# EAGLE design dog_treat_launcher (EAGLE 9.6.2)
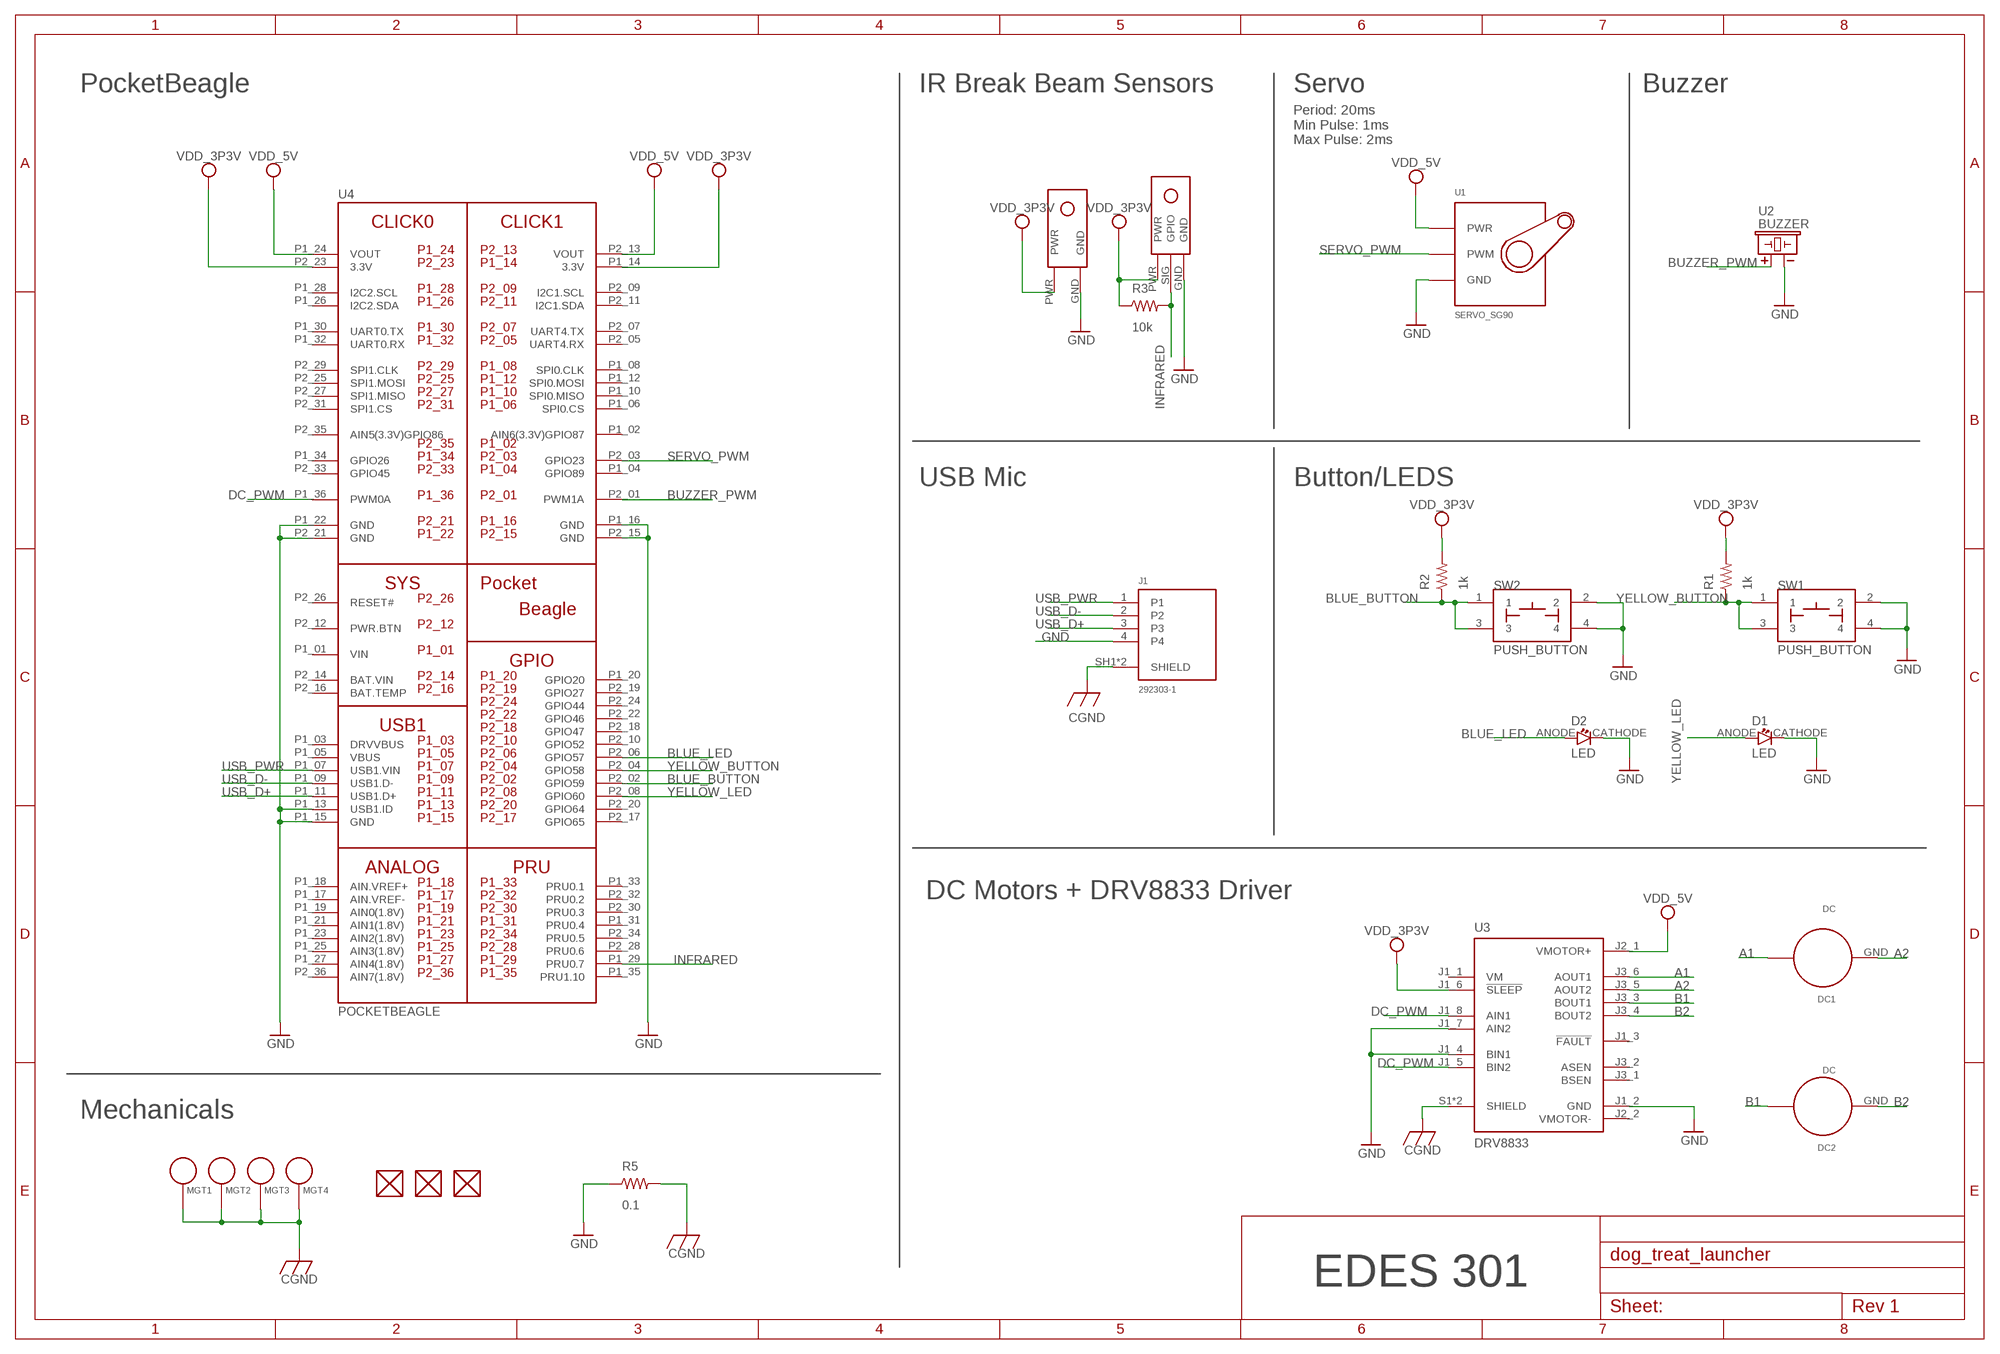
[diagram p0: schematic, sheet 1]

## Parts
D1  LED  [EIA-STD]
D2  LED  [EIA-STD]
DC1  DC  [DC_FOOTPRINT]
DC2  DC  [DC_FOOTPRINT]
FUD1  FIDUCIAL  [FIDUCIAL_40MIL]
FUD2  FIDUCIAL  [FIDUCIAL_40MIL]
FUD3  FIDUCIAL  [FIDUCIAL_40MIL]
IR_T1  IR_TRANSMITTER  [IR_T]
IT_R1  IR_RECIEVER  [IR_R]
J1  292303-1  [TE_292303-1]
MGT1  MOUNTING_HOLE  [MOUNTING_HOLE]
MGT2  MOUNTING_HOLE  [MOUNTING_HOLE]
MGT3  MOUNTING_HOLE  [MOUNTING_HOLE]
MGT4  MOUNTING_HOLE  [MOUNTING_HOLE]
R1  1k  R_R0402  [R0402]
R2  1k  R_R0402  [R0402]
R3  10k  R_R0402  [R0402]
R5  0.1  R_R0402  [R0402]
SW1  PUSH_BUTTON  [BUTTON_12.5MM]
SW2  PUSH_BUTTON  [BUTTON_12.5MM]
U1  SERVO_SG90  [SERVO-X1]
U2  BUZZER  [BUZZER_6.5MM]
U3  DRV8833  [MODULE_3297]
U4  POCKETBEAGLE  [POCKETBEAGLE]

## Nets
A1: DC1.PWR U3.J3_6(AOUT1)
A2: DC1.GND U3.J3_5(AOUT2)
B1: DC2.PWR U3.J3_3(BOUT1)
B2: DC2.GND U3.J3_4(BOUT2)
BLUE_BUTTON: R2.1 SW2.1 SW2.3 U4.P2_02(GPIO59)
BLUE_LED: D2.ANODE U4.P2_06(GPIO57)
BUZZER_PWM: U2.+ U4.P2_01(PWM1A)
CGND: J1.SH1(SHIELD) J1.SH2(SHIELD) MGT1.P$1 MGT2.P$1 MGT3.P$1 MGT4.P$1 R5.2 U3.S1(SHIELD) U3.S2(SHIELD)
DC_PWM: U3.J1_5(BIN2) U3.J1_8(AIN1) U4.P1_36(PWM0A)
GND: D1.CATHODE D2.CATHODE IR_T1.GND IT_R1.GND J1.4 R5.1 SW1.2 SW1.4 SW2.2 SW2.4 U1.GND U2.- U3.J1_2(GND) U3.J1_4(BIN1) U3.J1_7(AIN2) U4.P1_13(USB1.ID) U4.P1_15(GND) U4.P1_16(GND) U4.P1_22(GND) U4.P2_15(GND) U4.P2_21(GND)
INFRARED: IT_R1.SIG(GPIO) R3.2 U4.P1_29(PRU0.7)
SERVO_PWM: U1.SIG(PWM) U4.P2_03(GPIO23)
USB_D+: J1.3 U4.P1_11(USB1.D+)
USB_D-: J1.2 U4.P1_09(USB1.D-)
USB_PWR: J1.1 U4.P1_07(USB1.VIN)
VDD_3P3V: IR_T1.PWR IT_R1.PWR R1.2 R2.2 R3.1 U3.J1_6(!SLEEP) U4.P1_14(3.3V) U4.P2_23(3.3V)
VDD_5V: U1.PWR U3.J2_1(VMOTOR+) U4.P1_24(VOUT) U4.P2_13(VOUT)
YELLOW_BUTTON: R1.1 SW1.1 SW1.3 U4.P2_04(GPIO58)
YELLOW_LED: D1.ANODE U4.P2_08(GPIO60)
Unconnected: FUD1.P$1 FUD2.P$1 FUD3.P$1 U3.J1_1(VM) U3.J1_3(!FAULT) U3.J3_1(BSEN) U3.J3_2(ASEN) U4.P1_02(AIN6(3.3V)GPIO87) U4.P1_03(DRVVBUS) U4.P1_04(GPIO89) U4.P1_05(VBUS) U4.P1_06(SPI0.CS) U4.P1_08(SPI0.CLK) U4.P1_10(SPI0.MISO) U4.P1_12(SPI0.MOSI) U4.P1_17(AIN.VREF-) U4.P1_18(AIN.VREF+) U4.P1_19(AIN0(1.8V)) U4.P1_20(GPIO20) U4.P1_21(AIN1(1.8V)) U4.P1_23(AIN2(1.8V)) U4.P1_25(AIN3(1.8V)) U4.P1_26(I2C2.SDA) U4.P1_27(AIN4(1.8V)) U4.P1_28(I2C2.SCL) U4.P1_30(UART0.TX) U4.P1_31(PRU0.4) U4.P1_32(UART0.RX) U4.P1_33(PRU0.1) U4.P1_34(GPIO26) U4.P1_35(PRU1.10) U4.P2_05(UART4.RX) U4.P2_07(UART4.TX) U4.P2_09(I2C1.SCL) U4.P2_10(GPIO52) U4.P2_11(I2C1.SDA) U4.P2_12(PWR.BTN) U4.P2_16(BAT.TEMP) U4.P2_17(GPIO65) U4.P2_18(GPIO47) U4.P2_19(GPIO27) U4.P2_20(GPIO64) U4.P2_22(GPIO46) U4.P2_24(GPIO44) U4.P2_25(SPI1.MOSI) U4.P2_26(RESET#) U4.P2_27(SPI1.MISO) U4.P2_28(PRU0.6) U4.P2_29(SPI1.CLK) U4.P2_30(PRU0.3) U4.P2_31(SPI1.CS) U4.P2_32(PRU0.2) U4.P2_33(GPIO45) U4.P2_34(PRU0.5) U4.P2_35(AIN5(3.3V)GPIO86) U4.P2_36(AIN7(1.8V))

## Notes on the sheet
- PocketBeagle | IR Break Beam Sensors | Servo | Buzzer
- Period: 20ms
  Min Pulse: 1ms
  Max Pulse: 2ms
- USB Mic | Button/LEDS
- DC Motors + DRV8833 Driver
- Mechanicals
- EDES 301

## Power pins joined to a net without a drawn wire
BAT.VIN: U4.P2_14(BAT.VIN)
VIN: U4.P1_01(VIN)
VMOTOR-: U3.J2_2(VMOTOR-)

## Library data of the parts
D1 D2 = Dog_Treat_Launcher:LED: EIA-STD LED, LTST-C191T8KT
DC1 DC2 = Dog_Treat_Launcher:DC: Device representation of hobby DC Motor
FUD1-FUD3 = MISC:FIDUCIAL
IR_T1 = Dog_Treat_Launcher:IR_TRANSMITTER: Device representation of IR Break Beam Sensor
IT_R1 = Dog_Treat_Launcher:IR_RECIEVER: Device representation of Adafruit IR Break Beam Sensor Receiver
J1 = Dog_Treat_Launcher:292303-1: CONN USB RECEPT R/A TYPE A 4POS Check availability <https://pricing.snapeda.com/parts/292303-1/TE%20Connectivity/view-part?ref=eda>; AVAILABILITY: In Stock; CENTERLINE_PITCH: 2 mm[.078 in]; CHECK_PRICES: https://www.snapeda.com/parts/292303-1/TE+Connectivity+AMP+Connectors/view-part/?ref=eda; COMMENT: 292303-1; DESCRIPTION: Type A Standard USB Connector 4 Position Right Angle Mount 1 Port | TE Connectivity 292303-1; EU_ROHS_COMPLIANCE: Compliant; MF: TE Connectivity; MP: 292303-1; NUMBER_OF_POSITIONS: 4; PACKAGE: None; PRICE: None; PRODUCT_TYPE: Connector; SNAPEDA_LINK: https://www.snapeda.com/parts/292303-1/TE+Connectivity+AMP+Connectors/view-part/?ref=snap
MGT1-MGT4 = combo_lock:MOUNTING_HOLE: Chassis Mounting Hole w/GND connection ability
R1-R3 = Dog_Treat_Launcher:R_: RESISTOR, American symbol
R5 = MISC:R_: RESISTOR, American symbol
SW1 SW2 = Dog_Treat_Launcher:PUSH_BUTTON
U1 = Dog_Treat_Launcher:SERVO_SG90
U2 = Dog_Treat_Launcher:BUZZER: CEM-1203 Buzzer
U3 = Dog_Treat_Launcher:DRV8833: DRV8833 Motor Controller/Driver Power Management Evaluation Board Check availability <https://pricing.snapeda.com/parts/3297/Adafruit%20Industries/view-part?ref=eda>; AVAILABILITY: Not in stock; CHECK_PRICES: https://www.snapeda.com/parts/3297/Adafruit+Industries/view-part/?ref=eda; DESCRIPTION: DRV8833 Motor Controller/Driver Power Management Evaluation Board; MF: Adafruit Industries; MP: 3297; PACKAGE: None; PRICE: None; SNAPEDA_LINK: https://www.snapeda.com/parts/3297/Adafruit+Industries/view-part/?ref=snap
U4 = Dog_Treat_Launcher:POCKETBEAGLE

## Board
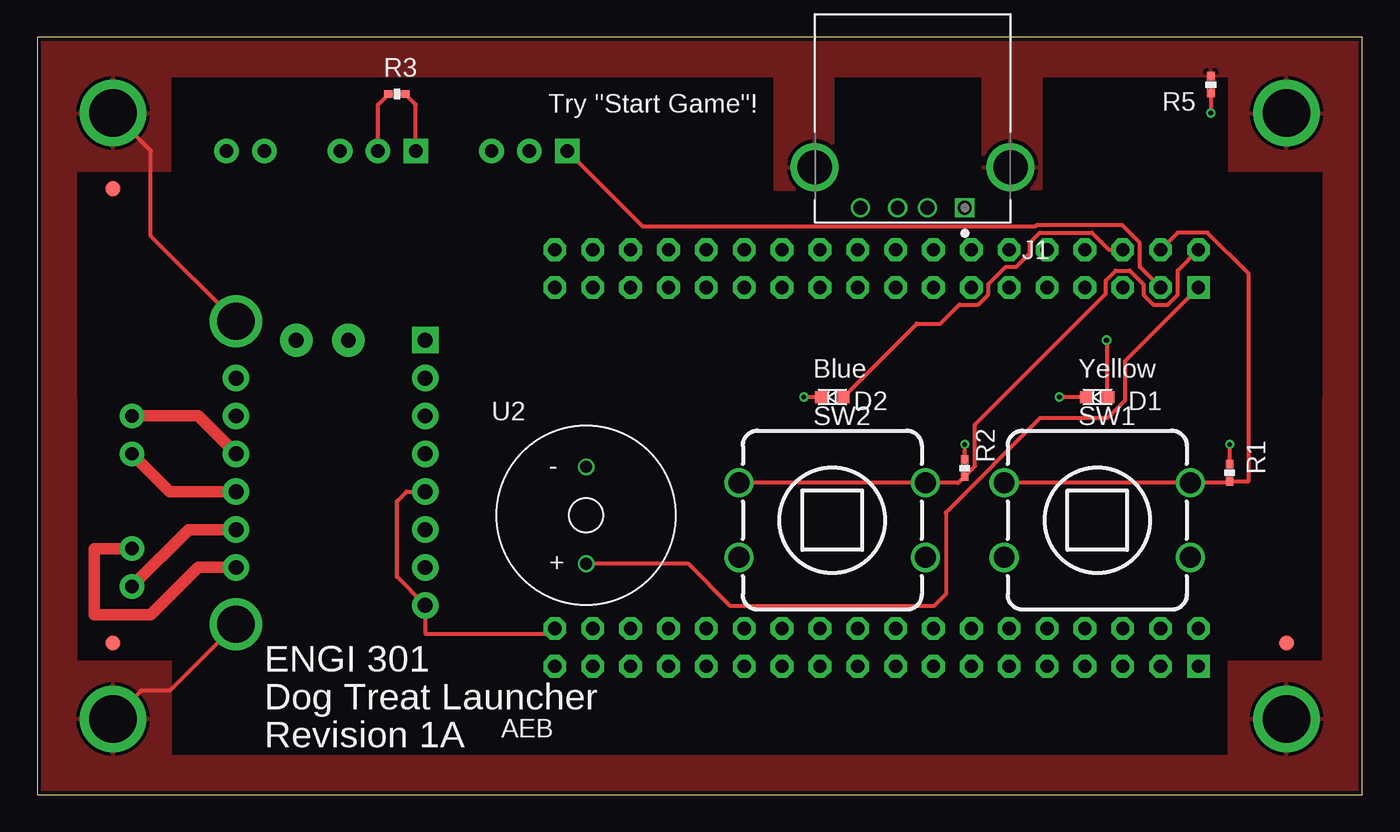
[diagram p1: board, top side]
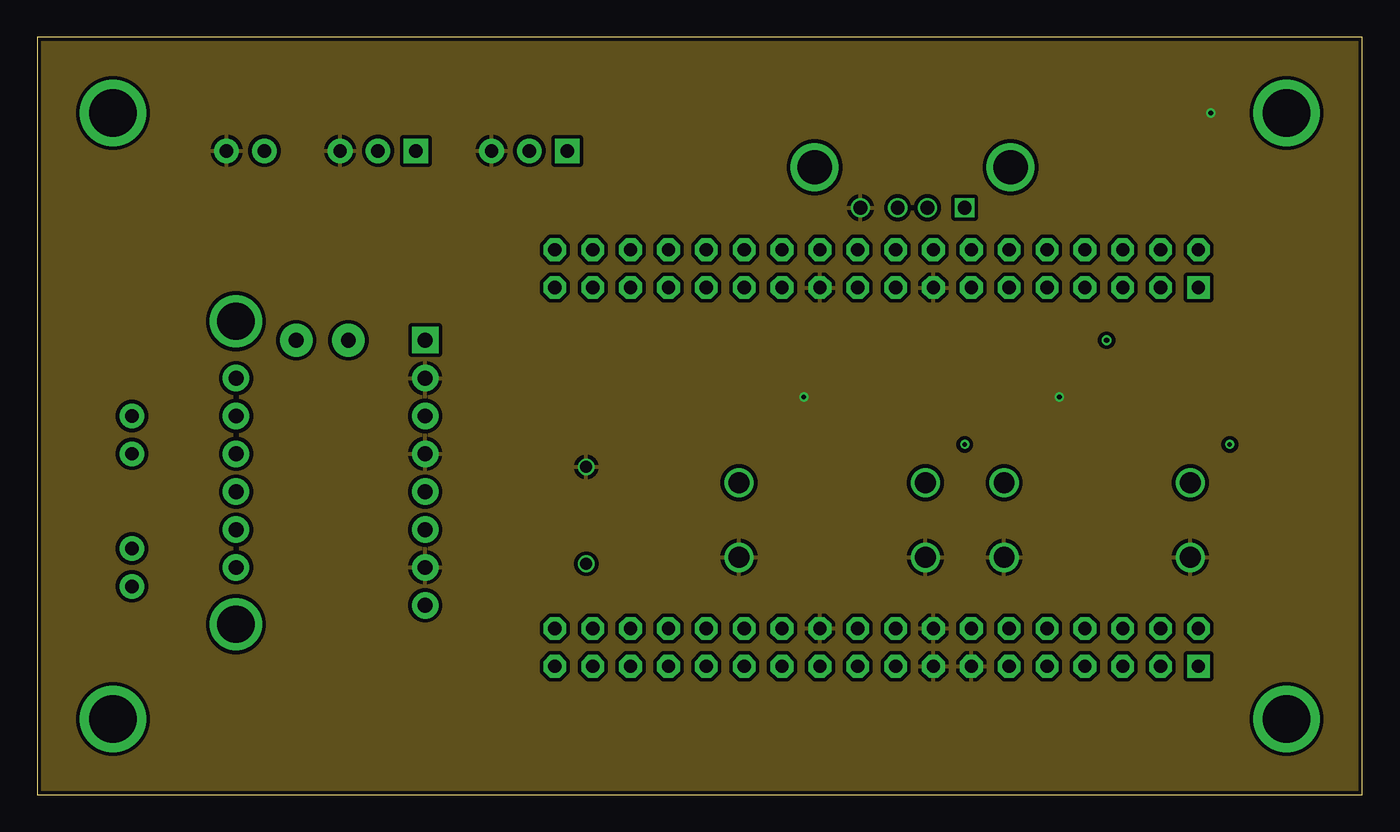
[diagram p2: board, inner layer Route2]
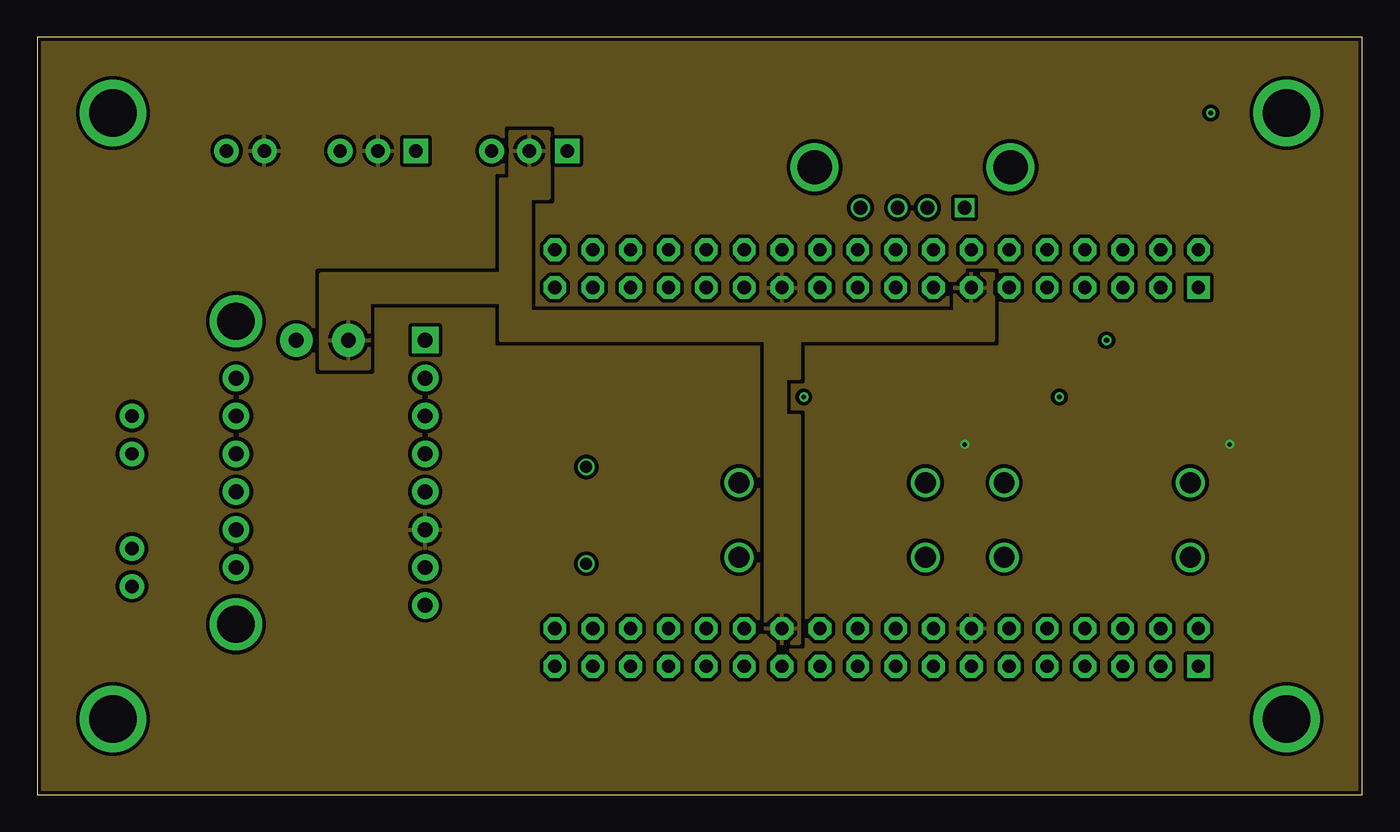
[diagram p3: board, inner layer Route15]
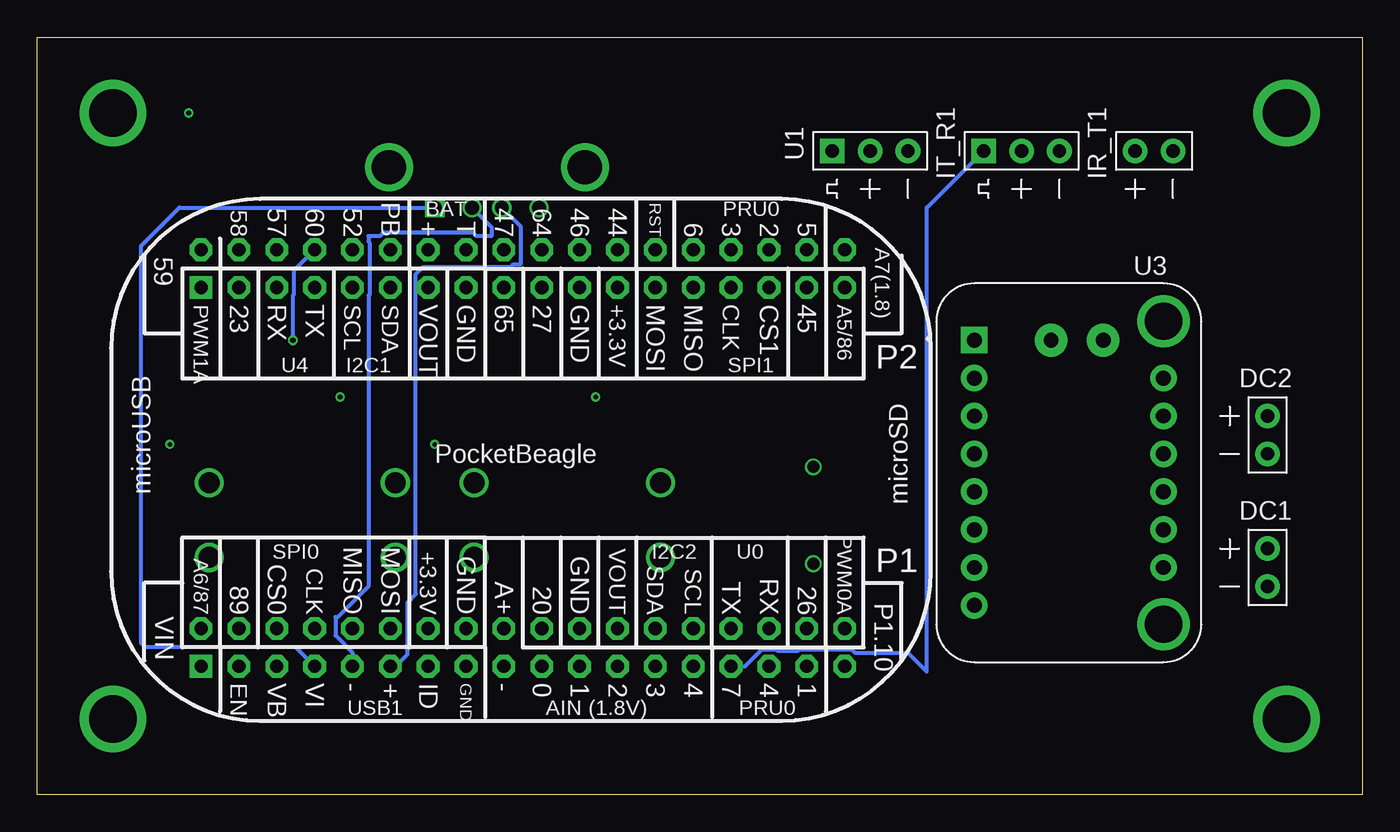
[diagram p4: board, bottom side, seen from below]

Size 88.9 x 50.8 mm. Coordinates in mm from the lower left corner, seen from the top.
Outline: 0,0 88.9,0 88.9,50.8 0,50.8 0,0
Copper layers (1*2*15*16): Top 0.035mm / dielectric 0.23mm / Route2 0.035mm / dielectric 0.93mm / Route15 0.035mm / dielectric 0.23mm / Bottom 0.035mm
Design rules "EDES301_4lyr": minimum track width 10mil, minimum drill 12mil, track to track 10mil, track to pad 10mil, pad to pad 10mil, via to via 10mil, smd to smd 10mil, copper to edge 10mil, drill to drill 12mil, minimum pad ring 6mil, minimum via ring 6mil, stop-mask expansion 3mil, vias tented up to drill 25mil, thermal gap 10mil

### Footprints (pad centres in the part's own frame; a part is rotated, then mirrored left to right if it is on the bottom)
EIA-STD = smd 0.8 x 0.8: ANODE -0.75,0; CATHODE 0.75,0
DC_FOOTPRINT = drill 0.889 pad 1.651: GND 0,-2.54; PWR 0,0
FIDUCIAL_40MIL = smd 1.016 x 1.016: P$1 0,0
IR_T = drill 0.889 pad 1.651: GND 0,-2.54; PWR 0,0
IR_R = drill 0.889 pad 1.651: GND 0,-2.54; PWR 0,0 | drill 0.889 pad 1.651 square: SIG 0,2.54
TE_292303-1 = drill 0.92 square: 1 0,0 | drill 0.92: 2 2.5,0; 3 4.5,0; 4 7,0 | drill 2.3: SH1 -3.07,-2.71; SH2 10.07,-2.71
MOUNTING_HOLE = drill 3.175 pad 4.445: P$1 0,0
R0402 = smd 0.61 x 0.508: 1 -0.559,0; 2 0.559,0
BUTTON_12.5MM = drill 1.4: 1 -6.25,2.5; 2 -6.25,-2.5; 3 6.25,2.5; 4 6.25,-2.5
SERVO-X1 = drill 0.889 pad 1.651: GND 0,-2.54; PWR 0,0 | drill 0.889 pad 1.651 square: SIG 0,2.54
BUZZER_6.5MM = drill 0.8: + 0,-3.25; - 0,3.25
MODULE_3297 = drill 1 pad 1.778 square: J1_1 -6.35,8.89 | drill 1 pad 1.778: J1_2 -6.35,6.35; J1_3 -6.35,3.81; J1_4 -6.35,1.27; J1_5 -6.35,-1.27; J1_6 -6.35,-3.81; J1_7 -6.35,-6.35; J1_8 -6.35,-8.89; J3_1 6.35,6.35; J3_2 6.35,3.81; J3_3 6.35,1.27; J3_4 6.35,-1.27; J3_5 6.35,-3.81; J3_6 6.35,-6.35 | drill 1 pad 2.184: J2_1 -1.192,8.89; J2_2 2.308,8.89 | drill 2.5 pad 3.2: S1 6.35,10.16; S2 6.35,-10.16
POCKETBEAGLE = drill 0.889 pad 1.524 square: P1_01 5.91,3.53; P2_01 5.91,28.93 | drill 0.889 pad 1.524 octagon: P1_02 5.91,6.07; P1_03 8.45,3.53; P1_04 8.45,6.07; P1_05 10.99,3.53; P1_06 10.99,6.07; P1_07 13.53,3.53; P1_08 13.53,6.07; P1_09 16.07,3.53; P1_10 16.07,6.07; P1_11 18.61,3.53; P1_12 18.61,6.07; P1_13 21.15,3.53; P1_14 21.15,6.07; P1_15 23.69,3.53; P1_16 23.69,6.07; P1_17 26.23,3.53; P1_18 26.23,6.07; P1_19 28.77,3.53; P1_20 28.77,6.07; P1_21 31.31,3.53; P1_22 31.31,6.07; P1_23 33.85,3.53; P1_24 33.85,6.07; P1_25 36.39,3.53; P1_26 36.39,6.07; P1_27 38.93,3.53; P1_28 38.93,6.07; P1_29 41.47,3.53; P1_30 41.47,6.07; P1_31 44.01,3.53; P1_32 44.01,6.07; P1_33 46.55,3.53; P1_34 46.55,6.07; P1_35 49.09,3.53; P1_36 49.09,6.07; P2_02 5.91,31.47; P2_03 8.45,28.93; P2_04 8.45,31.47; P2_05 10.99,28.93; P2_06 10.99,31.47; P2_07 13.53,28.93; P2_08 13.53,31.47; P2_09 16.07,28.93; P2_10 16.07,31.47; P2_11 18.61,28.93; P2_12 18.61,31.47; P2_13 21.15,28.93; P2_14 21.15,31.47; P2_15 23.69,28.93; P2_16 23.69,31.47; P2_17 26.23,28.93; P2_18 26.23,31.47; P2_19 28.77,28.93; P2_20 28.77,31.47; P2_21 31.31,28.93; P2_22 31.31,31.47; P2_23 33.85,28.93; P2_24 33.85,31.47; P2_25 36.39,28.93; P2_26 36.39,31.47; P2_27 38.93,28.93; P2_28 38.93,31.47; P2_29 41.47,28.93; P2_30 41.47,31.47; P2_31 44.01,28.93; P2_32 44.01,31.47; P2_33 46.55,28.93; P2_34 46.55,31.47; P2_35 49.09,28.93; P2_36 49.09,31.47

### Placement (x,y rotation side)
D1  71.12,26.67 180 top
D2  53.34,26.67 180 top
DC1  6.35,16.51 0 bottom
DC2  6.35,25.4 0 bottom
FUD1  5.08,10.16 0 top
FUD2  5.08,40.64 0 top
FUD3  83.82,10.16 0 top
IR_T1  15.24,43.18 90 bottom
IT_R1  22.86,43.18 90 bottom
J1  62.23,39.37 180 top
MGT1  83.82,45.72 0 top
MGT2  5.08,45.72 0 top
MGT3  83.82,5.08 0 top
MGT4  5.08,5.08 0 top
R1  80.01,21.59 90 top
R2  62.23,21.91 90 top
R3  24.13,46.99 0 top
R5  78.74,47.62 90 top
SW1  71.12,18.41 0 top
SW2  53.34,18.41 0 top
U1  33.02,43.18 90 bottom
U2  36.83,18.73 0 top
U3  19.68,21.59 0 bottom
U4  83.82,5.08 0 bottom

### Tracks (layer width: path | path; a pad name or v marks a point on that pad's centre or on a via)
A1
  Top 0.762: U3.J3_6 10.8,15.24 7.62,12.06 3.81,12.06 3.81,16.51 DC1.PWR
A2
  Top 0.762: U3.J3_5 10.16,17.78 DC1.GND
B1
  Top 0.762: DC2.PWR 10.8,25.4 U3.J3_3
B2
  Top 0.762: U3.J3_4 8.89,20.32 DC2.GND
BLUE_BUTTON
  Top 0.254: SW2.1 SW2.3 61.8,20.91 R2.1 62.92,22.04 62.92,24.82 71.69,33.59 71.69,34.48 72.36,35.15 73.3,35.15 74.23,34.23 74.23,33.54 74.9,32.87 75.84,32.87 76.51,33.54 76.51,35.15 U4.P2_02
BLUE_LED
  Top 0.254: D2.ANODE 59.02,31.6 60.6,31.6 61.87,32.87 63.14,32.87 63.81,33.54 63.81,34.23 64.99,35.41 65.68,35.41 66.61,36.33 66.61,37.02 67.28,37.69 70.76,37.69 71.91,36.55 U4.P2_06
BUZZER_PWM
  Top 0.254: U2.+ 43.69,15.48 46.53,12.65 60.15,12.65 60.95,13.45 60.95,18.92 67.28,25.25 71.79,25.25 72.97,26.43 72.97,29.07 U4.P2_01
CGND
  Top 0.254: U3.S1 7.62,37.47 7.62,43.18 MGT2.P$1 | U3.S2 8.89,6.99 6.98,6.99 MGT4.P$1
  pour Top: 80.01,8.89 86.36,8.89 86.36,26.67 91.44,26.67 91.44,-2.54 -2.54,-2.54 -2.54,26.67 2.54,26.67 2.54,8.89 8.89,8.89 8.89,2.54 80.01,2.54
  pour Top: 2.54,26.67 2.54,41.91 8.89,41.91 8.89,48.26 80.01,48.26 80.01,41.91 86.36,41.91 86.36,27.94 86.36,26.67 91.44,26.67 91.44,53.34 -2.54,53.34 -2.54,26.67
  pour Top: 49.53,48.26 49.53,40.64 53.34,40.64 53.34,48.26
  pour Top: 67.31,48.26 67.31,40.64 64.77,40.64 63.5,40.64 63.5,48.26
DC_PWM
  Top 0.254: U4.P1_36 34.38,10.79 26.04,10.79 U3.J1_8 24.13,14.61 24.13,19.68 24.77,20.32 U3.J1_5
GND  (via drill 0.3 pad 0.61)
  Top 0.254: D2.CATHODE v51.44,26.67 | D1.CATHODE v68.58,26.67 | R5.1 v78.74,45.72
  pour Route2: -5.08,-5.08 -5.08,55.88 93.98,55.88 93.98,-5.08
INFRARED
  Top 0.254: IT_R1.SIG 25.4,46.28 R3.2
  Bottom 0.254: IT_R1.SIG 29.21,39.37 29.21,8.26 30.48,9.53 34.03,9.53 34.26,9.75 37.74,9.75 37.84,9.66 39.24,9.66 39.34,9.75 40.28,9.75 41.43,8.61 U4.P1_29
SERVO_PWM
  Top 0.254: U4.P2_03 73.97,35.41 73.97,37.02 72.8,38.2 67.07,38.2 66.97,38.1 40.64,38.1 U1.SIG
USB_D+
  Bottom 0.254: U4.P1_11 65.34,8.74 64.74,8.74 64.07,9.41 64.07,12.89 63.51,13.45 63.51,34.92 63.02,35.41 57.12,35.41 56.96,35.56 56.52,35.56 56.45,35.63 56.45,38.09 J1.3
USB_D-
  Bottom 0.254: U4.P1_09 67.75,9.53 68.89,10.68 68.89,11.91 68.73,11.91 66.67,13.97 66.67,33.47 66.61,33.54 66.61,37.02 66.67,37.09 66.67,37.47 65.91,37.47 65.68,37.69 59.66,37.69 59.43,37.47 58.42,37.47 58.42,38.06 J1.2
USB_PWR
  Bottom 0.254: U4.P1_07 71.56,9.88 81.63,9.88 81.91,10.16 81.91,36.83 79.38,39.37 J1.1
VDD_3P3V  (via drill 0.3 pad 0.61)
  Top 0.254: R2.2 v62.23,23.5 | R1.2 v80.01,23.5 | IT_R1.PWR 22.86,46.28 R3.1
  pour Route15 (rank 6): -7.62,-7.62 -7.62,58.42 96.52,58.42 96.52,-7.62
VDD_5V
  pour Route15 (isolate 0.305): 61.59,34.92 64.13,34.92 64.13,30.48 31.11,30.48 31.11,41.27 31.75,41.27 31.75,44.45 34.29,44.45 34.29,40.01 33.02,40.01 33.02,32.38 61.59,32.38
  pour Route15 (isolate 0.305): 31.11,33.02 22.22,33.02 22.22,28.57 19.05,28.57 19.05,34.92 31.11,34.92
  pour Route15: 51.12,30.48 51.12,27.94 50.17,27.94 50.17,25.4 51.12,25.4 51.12,10.16 48.89,10.16 48.89,30.48
YELLOW_BUTTON
  Top 0.254: SW1.1 SW1.3 79.89,20.91 R1.1 81.28,21.03 81.28,34.92 78.51,37.69 76.51,37.69 U4.P2_04
YELLOW_LED  (via drill 0.35)
  Top 0.254: D1.ANODE 71.75,26.79 v71.75,30.48
  Bottom 0.254: U4.P2_08 71.69,35.15 71.69,33.66 71.69,33.54 71.75,33.47 v71.75,30.48

### Text on the board
tPlace: Try "Start Game"! | Blue | Yellow | ENGI 301 | Dog Treat Launcher | AEB | Revision 1A